# Altium schematic sheet stm32f401ret61_stm32f401ret6.schdoc
size 127 x 124 mm
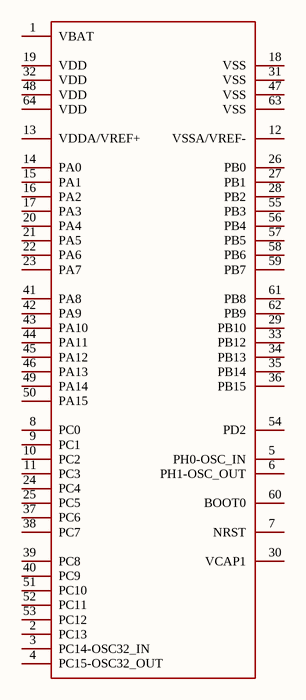
[diagram p0: stm32f401ret61_stm32f401ret6.schdoc]

## Parts
U?  STM32F401RET6  [LQFP-64_L10.0-W10.0-P0.50-LS12.0-BL]  (value not drawn)

## Nets

Not connected (* = marked no-connect by the designer): U? 1(VBAT) 2(PC13) 3(PC14-OSC32_IN) 4(PC15-OSC32_OUT) 5(PH0-OSC_IN) 6(PH1-OSC_OUT) 7(NRST) 8(PC0) 9(PC1) 10(PC2) 11(PC3) 12(VSSA/VREF-) 13(VDDA/VREF+) 14(PA0) 15(PA1) 16(PA2) 17(PA3) 18(VSS) 19(VDD) 20(PA4) 21(PA5) 22(PA6) 23(PA7) 24(PC4) 25(PC5) 26(PB0) 27(PB1) 28(PB2) 29(PB10) 30(VCAP1) 31(VSS) 32(VDD) 33(PB12) 34(PB13) 35(PB14) 36(PB15) 37(PC6) 38(PC7) 39(PC8) 40(PC9) 41(PA8) 42(PA9) 43(PA10) 44(PA11) 45(PA12) 46(PA13) 47(VSS) 48(VDD) 49(PA14) 50(PA15) 51(PC10) 52(PC11) 53(PC12) 54(PD2) 55(PB3) 56(PB4) 57(PB5) 58(PB6) 59(PB7) 60(BOOT0) 61(PB8) 62(PB9) 63(VSS) 64(VDD)

## Library data of the parts
U? = STM32F401RET6: Manufacturer: ST(意法半导体); Add into BOM: yes; CPU Core: ARM-M4; Program Storage Size: 512KB; GPIO Ports Number: 50; Operating Voltage Range: 1.7V~3.6V; CPU Maximum Speed: 84MHz; ADC (Bit): 12bit; Universal Serial Bus: 有; Symbol: stm32f401ret6; Device: STM32F401RET6; LCSC Part Name: 带DSP和FPU的STM32动态效率ARM Cortex-M4 MCU，具有最大512 KB Flash、84 MHz CPU和ART加速器; Supplier Part: C116978; Manufacturer Part: STM32F401RET6; Supplier Footprint: LQFP-64(10x10); JLCPCB Part Class: Extended Part; Datasheet: https://atta.szlcsc.com/upload/public/pdf/source/20180130/C161736_15172973410651323369.pdf; Supplier: LCSC; Convert to PCB: yes; Operating Temperature Range: -40℃~+85℃; Watchdog: 有; Infrared Data Association: 有; Low-Voltage Detect: 有; Secure Digital Input and Output: 有; Direct Memory Access: 有; Internal Oscillator: 有